# Altium schematic sheet 1_P1.schdoc.schdoc (part 2 of 2)
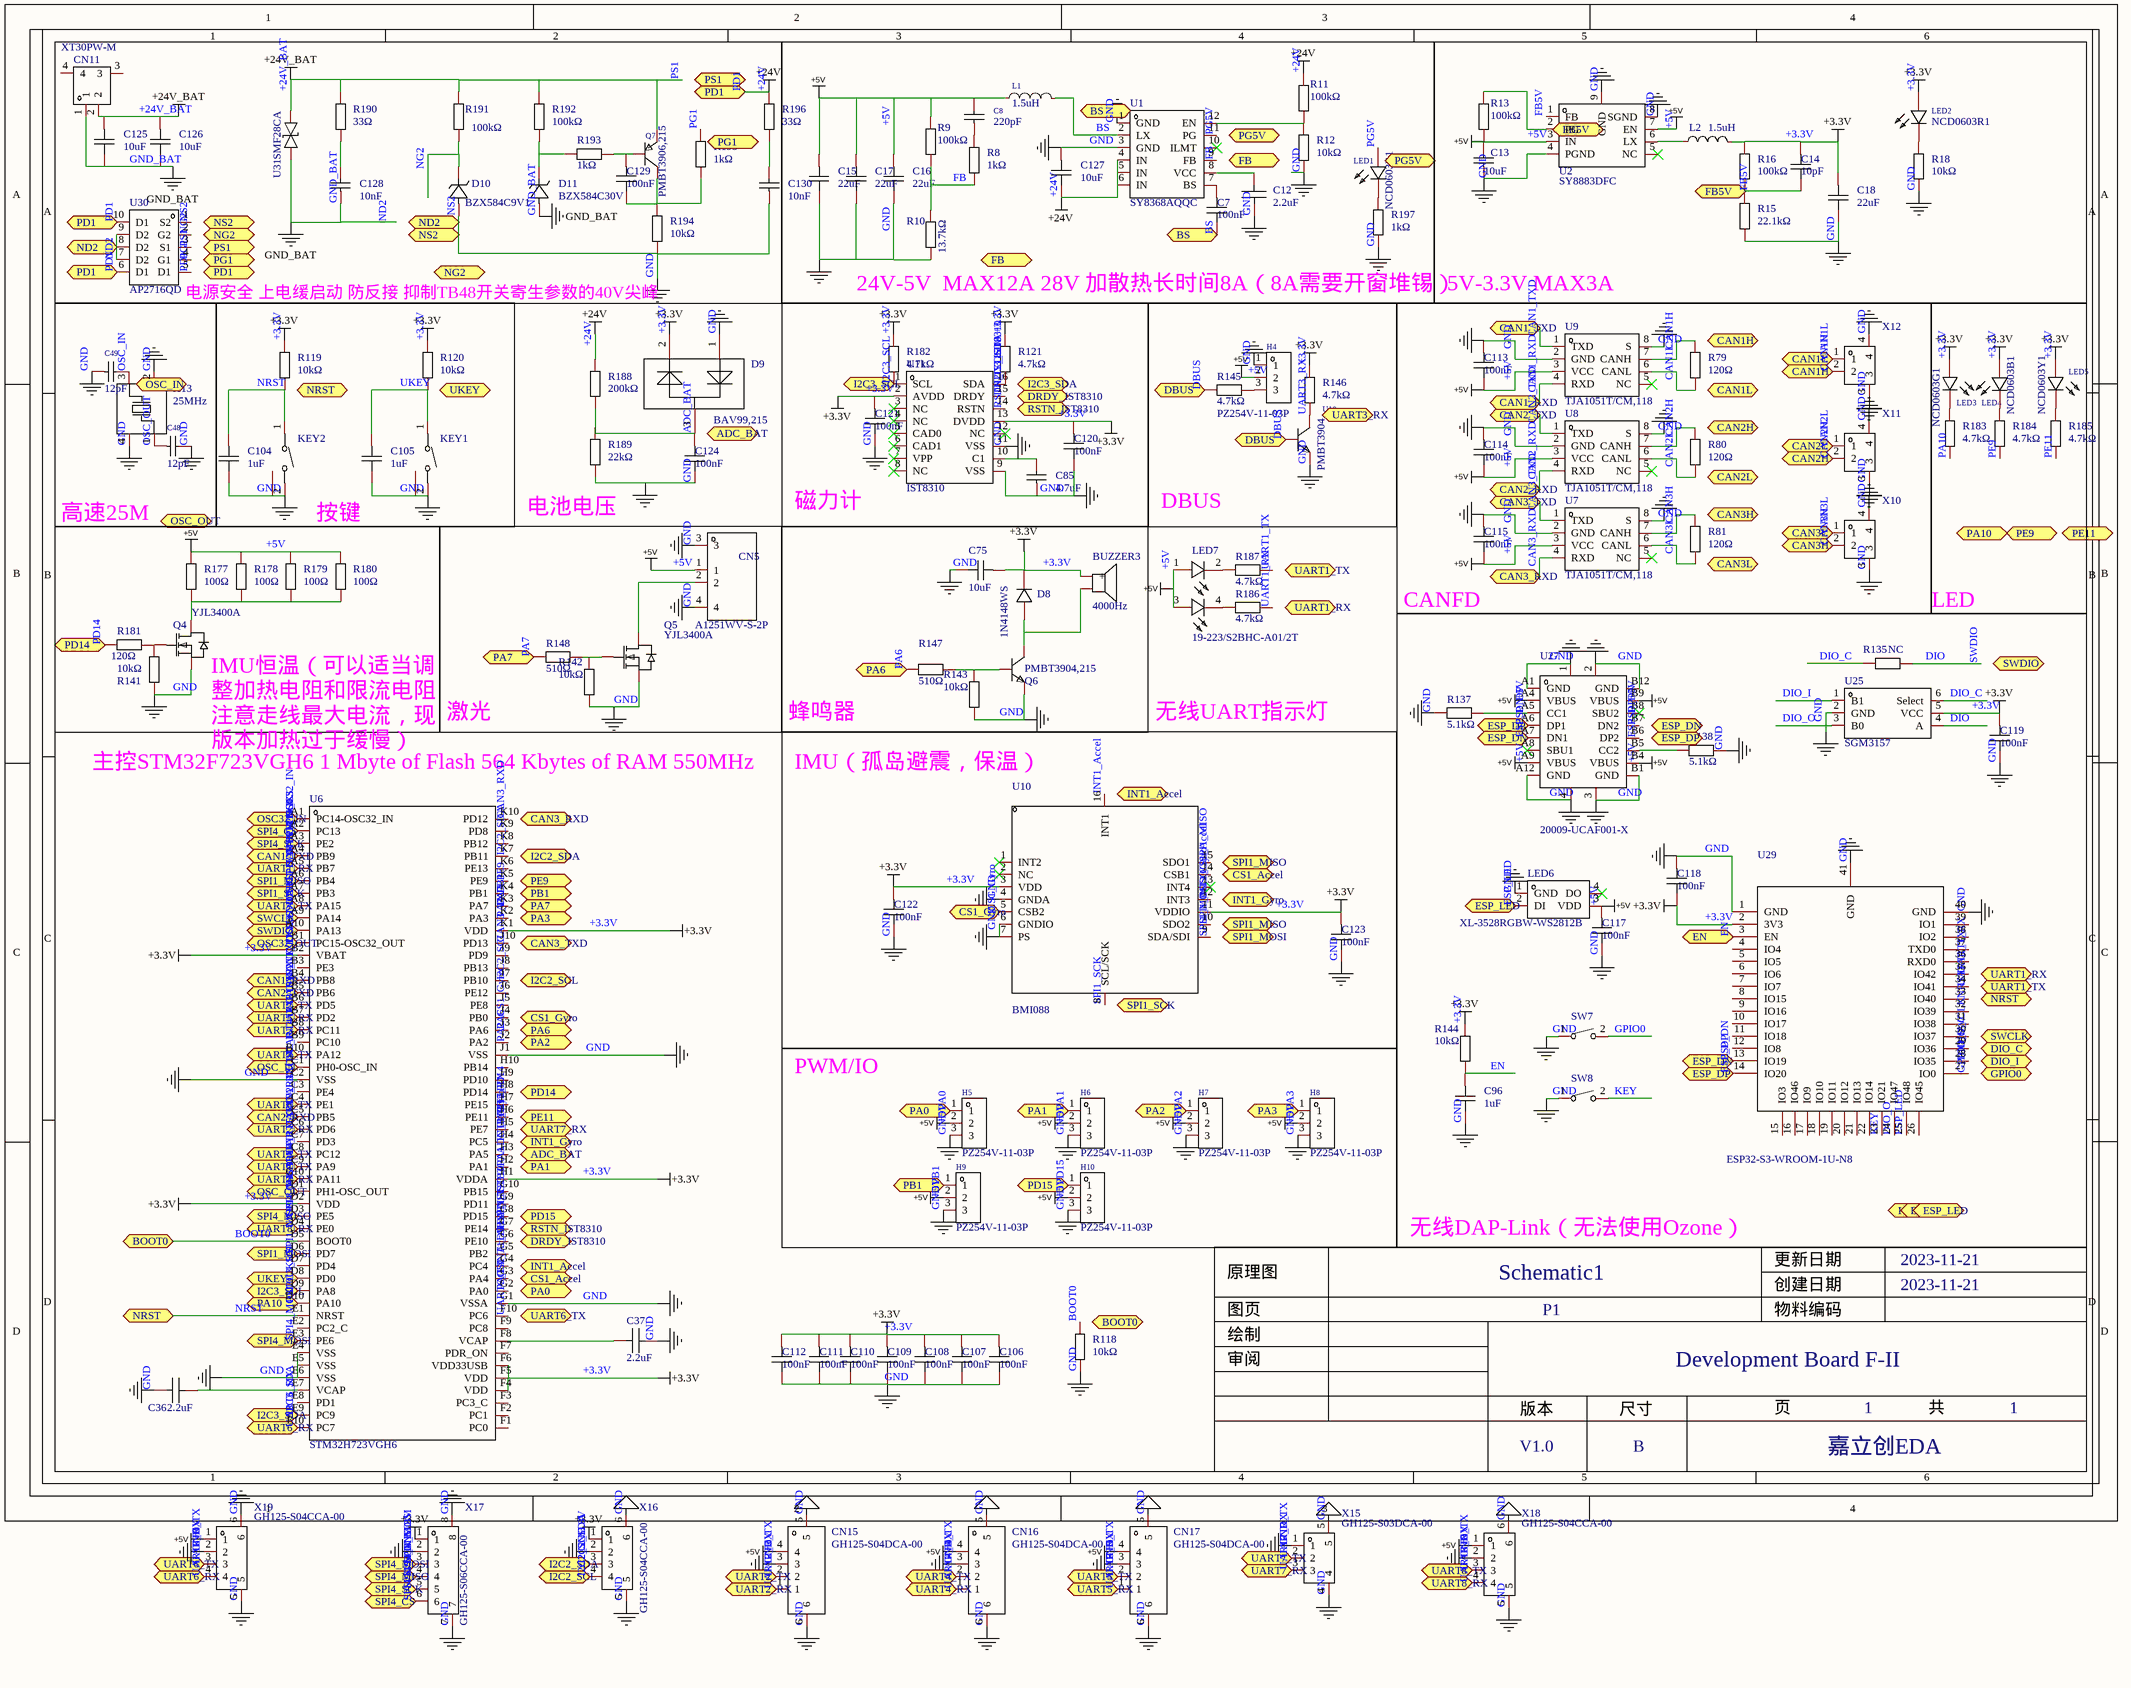
[diagram p1: 1_P1.schdoc.schdoc]

## Library data of the parts
BUZZER3 = FUET-4020: 驱动方式:无源(外部驱动);构造类型:电磁式;额定电压:3V;工作电压:2V~4V;频率:4000Hz;声压(SPL):65dB@3V,10cm;长度:4mm;宽度:4mm;高度:2.5mm;; Manufacturer: FUET(福声科技); Add into BOM: yes; Technology Type: 电磁式; Rated Voltage: 3V; Operating Voltage: 2V~4V; Name: 4000Hz; Symbol: FST-4020; Device: FUET-4020; LCSC Part Name: 电压 3V 频率 4KHZ; Supplier Part: C391027; Manufacturer Part: FUET-4020; Supplier Footprint: SMD; JLCPCB Part Class: 扩展库; Datasheet: https://atta.szlcsc.com/upload/public/pdf/source/20191031/C391027_1FC1E5FCD05180B5ABC7B83EB3465454.pdf; Supplier: LCSC; Convert to PCB: yes; Oscillator Circuit: 无源(外部驱动); Value: 4000Hz; Sound Pressure Level (SPL): 65dB@3V,10cm; Length: 4mm; Width: 4mm; Height: 2.5mm
C7 C106-C115 C117-C124 C129 = CL05B104KB54PNC: 容值:100nF;精度:±10%;额定电压:50V;材质(温度系数):X7R;; Manufacturer: SAMSUNG(三星); Add into BOM: yes; Tolerance: ±10%; Voltage Rated: 50V; Temperature Coefficient: X7R; Name: 100nF; Symbol: CL05B104KB54PNC; Device: CL05B104KB54PNC; LCSC Part Name: 100nF ±10% 50V; Supplier Part: C307331; Manufacturer Part: CL05B104KB54PNC; Supplier Footprint: 0402; JLCPCB Part Class: 基础库; Datasheet: https://atta.szlcsc.com/upload/public/pdf/source/20181009/C307331_222F7C870FD3EA5F46F538B483443886.pdf; Supplier: LCSC; Convert to PCB: yes; Value: 100nF
C8 = 0402B221K500NT: 容值:220pF;精度:±10%;额定电压:50V;材质(温度系数):X7R;; Manufacturer: FH(风华); Add into BOM: yes; Tolerance: ±10%; Voltage Rated: 50V; Temperature Coefficient: X7R; Name: 220pF; Symbol: 0402B221K500NT; Device: 0402B221K500NT; LCSC Part Name: 220pF ±10% 50V; Supplier Part: C1530; Manufacturer Part: 0402B221K500NT; Supplier Footprint: 0402; JLCPCB Part Class: 基础库; Datasheet: https://atta.szlcsc.com/upload/public/pdf/source/20200305/C486355_26A10D38EF8C2A5C37091D0039909270.pdf; Supplier: LCSC; Convert to PCB: yes; Value: 220pF; Capacitance: 220pF
C12 C36 C37 = CL05A225MQ5NSNC: 容值:2.2uF;精度:±20%;额定电压:6.3V;材质(温度系数):X5R;; Manufacturer: SAMSUNG(三星); Add into BOM: yes; Tolerance: ±20%; Voltage Rated: 6.3V; Temperature Coefficient: X5R; Name: 2.2uF; Symbol: CL05A225MQ5NSNC; Device: CL05A225MQ5NSNC; LCSC Part Name: 2.2uF ±20% 6.3V; Supplier Part: C12530; Manufacturer Part: CL05A225MQ5NSNC; Supplier Footprint: 0402; Datasheet: https://atta.szlcsc.com/upload/public/pdf/source/20160103/1457707666860.pdf; Supplier: LCSC; Convert to PCB: yes; Value: 2.2uF
  C12: JLCPCB Part Class: 基础库
  C36 C37: JLCPCB Part Class: Basic Part
C13 = CL05A106MQ5NUNC: 容值:10uF;精度:±20%;额定电压:6.3V;材质(温度系数):X5R;; Manufacturer: SAMSUNG(三星); Add into BOM: yes; Tolerance: ±20%; Voltage Rated: 6.3V; Temperature Coefficient: X5R; Name: 10uF; Symbol: CL05A106MQ5NUNC; Device: CL05A106MQ5NUNC; LCSC Part Name: 10uF ±20% 6.3V; Supplier Part: C15525; Manufacturer Part: CL05A106MQ5NUNC; Supplier Footprint: 0402; JLCPCB Part Class: 基础库; Datasheet: https://atta.szlcsc.com/upload/public/pdf/source/20220823/2B02EE04F8F211D38A52DCB16EB6BEBA.pdf; Supplier: LCSC; Convert to PCB: yes; Value: 10uF
C14 = CL05C100JB5NNNC: 容值:10pF;精度:±5%;额定电压:50V;材质(温度系数):C0G;; Manufacturer: SAMSUNG(三星); Add into BOM: yes; Tolerance: ±5%; Voltage Rated: 50V; Temperature Coefficient: C0G; Name: 10pF; Symbol: CL05C100JB5NNNC; Device: CL05C100JB5NNNC; LCSC Part Name: 10pF ±5% 50V; Supplier Part: C32949; Manufacturer Part: CL05C100JB5NNNC; Supplier Footprint: 0402; JLCPCB Part Class: 基础库; Datasheet: https://atta.szlcsc.com/upload/public/pdf/source/20160103/1457707722238.pdf; Supplier: LCSC; Convert to PCB: yes; Value: 10pF
C15-C18 = CL10A226MQ8NRNC: 容值:22uF;精度:±20%;额定电压:6.3V;材质(温度系数):X5R;; Manufacturer: SAMSUNG(三星); Add into BOM: yes; Tolerance: ±20%; Voltage Rated: 6.3V; Temperature Coefficient: X5R; Name: 22uF; Symbol: CL10A226MQ8NRNC; Device: CL10A226MQ8NRNC; LCSC Part Name: 22uF ±20% 6.3V; Supplier Part: C59461; Manufacturer Part: CL10A226MQ8NRNC; Supplier Footprint: 0603; JLCPCB Part Class: 基础库; Datasheet: https://atta.szlcsc.com/upload/public/pdf/source/20160218/1457707763339.pdf; Supplier: LCSC; Convert to PCB: yes; Value: 22uF
C48 C49 = 0402CG120J500NT: 容值:12pF;精度:±5%;额定电压:50V;材质(温度系数):C0G;; Manufacturer: FH(风华); Add into BOM: yes; Tolerance: ±5%; Voltage Rated: 50V; Temperature Coefficient: C0G; Name: 12pF; Symbol: 0402CG120J500NT; Device: 0402CG120J500NT; LCSC Part Name: 12pF ±5% 50V; Supplier Part: C1547; Manufacturer Part: 0402CG120J500NT; Supplier Footprint: 0402; JLCPCB Part Class: Basic Part; Datasheet: https://atta.szlcsc.com/upload/public/pdf/source/20200305/C486355_26A10D38EF8C2A5C37091D0039909270.pdf; Supplier: LCSC; Convert to PCB: yes; Value: 12pF; Capacitance: 12pF
C75 = CL10A106MA8NRNC: 容值:10uF;精度:±20%;额定电压:25V;材质(温度系数):X5R;; Manufacturer: SAMSUNG(三星); Add into BOM: yes; Tolerance: ±20%; Voltage Rated: 25V; Temperature Coefficient: X5R; Name: 10uF; Symbol: CL10A106MA8NRNC; Device: CL10A106MA8NRNC; LCSC Part Name: 10uF ±20% 25V; Supplier Part: C96446; Manufacturer Part: CL10A106MA8NRNC; Supplier Footprint: 0603; JLCPCB Part Class: 基础库; Datasheet: https://atta.szlcsc.com/upload/public/pdf/source/20170325/1490427913016.pdf; Supplier: LCSC; Convert to PCB: yes; Value: 10uF
C85 = CL05A475MP5NRNC: 容值:4.7uF;精度:±20%;额定电压:10V;材质(温度系数):X5R;; Manufacturer: SAMSUNG(三星); Add into BOM: yes; Tolerance: ±20%; Voltage Rated: 10V; Temperature Coefficient: X5R; Name: 4.7uF; Symbol: CL05A475MP5NRNC; Device: CL05A475MP5NRNC; LCSC Part Name: 4.7uF ±20% 10V; Supplier Part: C23733; Manufacturer Part: CL05A475MP5NRNC; Supplier Footprint: 0402; JLCPCB Part Class: 基础库; Datasheet: https://atta.szlcsc.com/upload/public/pdf/source/20160103/1457707710457.pdf; Supplier: LCSC; Convert to PCB: yes; Value: 4.7uF
C96 C104 C105 = CL05A105KA5NQNC: 容值:1uF;精度:±10%;额定电压:25V;材质(温度系数):X5R;; Manufacturer: SAMSUNG(三星); Add into BOM: yes; Tolerance: ±10%; Voltage Rated: 25V; Temperature Coefficient: X5R; Name: 1uF; Symbol: CL05A105KA5NQNC; Device: CL05A105KA5NQNC; LCSC Part Name: 1uF ±10% 25V; Supplier Part: C52923; Manufacturer Part: CL05A105KA5NQNC; Supplier Footprint: 0402; JLCPCB Part Class: 基础库; Datasheet: https://atta.szlcsc.com/upload/public/pdf/source/20160103/1457707735223.pdf; Supplier: LCSC; Convert to PCB: yes; Value: 1uF
C125-C127 = GRM21BR61H106KE43L: 容值:10uF;精度:±10%;额定电压:50V;材质(温度系数):X5R;; Manufacturer: muRata(村田); Add into BOM: yes; Tolerance: ±10%; Voltage Rated: 50V; Temperature Coefficient: X5R; Name: 10uF; Symbol: GRM21BR61H106KE43L; Device: GRM21BR61H106KE43L; LCSC Part Name: 10uF ±10% 50V; Supplier Part: C440198; Manufacturer Part: GRM21BR61H106KE43L; Supplier Footprint: 0805; JLCPCB Part Class: 基础库; Datasheet: https://atta.szlcsc.com/upload/public/pdf/source/20191220/C440198_2DEA1B9834E321C8893F7972E9DFE5B0.pdf; Supplier: LCSC; Convert to PCB: yes; Value: 10uF
C128 C130 = CL05B103KB5NNNC: 容值:10nF;精度:±10%;额定电压:50V;材质(温度系数):X7R;; Manufacturer: SAMSUNG(三星); Add into BOM: yes; Tolerance: ±10%; Voltage Rated: 50V; Temperature Coefficient: X7R; Name: 10nF; Symbol: CL05B103KB5NNNC; Device: CL05B103KB5NNNC; LCSC Part Name: 10nF ±10% 50V; Supplier Part: C15195; Manufacturer Part: CL05B103KB5NNNC; Supplier Footprint: 0402; JLCPCB Part Class: 基础库; Datasheet: https://atta.szlcsc.com/upload/public/pdf/source/20160103/1457707674468.pdf; Supplier: LCSC; Convert to PCB: yes; Value: 10nF
CN5 = A1251WV-S-2P: 参考系列:-;间距:1.25mm;插针结构:1x2P;排数:1;每排PIN数:2;行距:-;安装方式:-;触头材质:磷青铜;; Manufacturer: CJT(长江连接器); Add into BOM: yes; Pitch: 1.25mm; Pins Structure: 1x2P; Number of PINs Per Row: 2; Name: A1251WV-S-2P; Symbol: A1251WV-S-2P; Device: A1251WV-S-2P; LCSC Part Name: 1.25mm 1x2P 镀锡; Supplier Part: C225104; Manufacturer Part: A1251WV-S-2P; Supplier Footprint: SMD,P=1.25mm; JLCPCB Part Class: 扩展库; Datasheet: https://atta.szlcsc.com/upload/public/pdf/source/20180509/C225104_35B4868FFB7D8A864E1EEFC552D9B5A2.pdf; Supplier: LCSC; Convert to PCB: yes; Reference Series: -; Number of Rows: 1; Row Spacing: -; Mounting Style: -; Contact Material: 磷青铜
CN11 = XT30PW-M: Socket,DCsupply,XT30,male,PIN:2; Manufacturer: AMASS(艾迈斯); Add into BOM: yes; Name: XT30PW-M; Symbol: XT30PW-M; Device: XT30PW-M; LCSC Part Name: AMASS(艾迈斯)航模插头 卧式弯脚 XT30PW-M公头; Supplier Part: C431092; Manufacturer Part: XT30PW-M; Supplier Footprint: -; JLCPCB Part Class: Extended Part; Datasheet: https://atta.szlcsc.com/upload/public/pdf/source/20220222/6A9F22F7850E25B33E1BE430ADF8560B.pdf; Supplier: LCSC; Convert to PCB: yes
CN15-CN17 = GH125-S04DCA-00: 参考系列:-;间距:1.25mm;插针结构:1x4P;排数:1;每排PIN数:4;行距:-;公母:公型插针;安装方式:卧贴;额定电流:1A;工作温度范围:-25℃~+85℃;; Manufacturer: JS(钜硕电子); Add into BOM: yes; Pitch: 1.25mm; Pins Structure: 1x4P; Number of PINs Per Row: 4; Gender: 公型插针; Current Rating (Max): 1A; Name: GH125-S04DCA-00; Symbol: GH125-S04DCA-00; Device: GH125-S04DCA-00; LCSC Part Name: GH1.25卧式贴片 带扣; Supplier Part: C2886767; Manufacturer Part: GH125-S04DCA-00; Supplier Footprint: SMD,P=1.25mm; JLCPCB Part Class: 扩展库; Datasheet: https://atta.szlcsc.com/upload/public/pdf/source/20210818/CD11791E5ED3EDF45A7009E9C8A2BD4C.pdf; Supplier: LCSC; Convert to PCB: yes; Reference Series: -; Number of Rows: 1; Row Spacing: -; Mounting Style: 卧贴; Operating Temperature Range: -25℃~+85℃
D8 = 1N4148WS_C2128: 二极管配置:独立式;功率:200mW;直流反向耐压(Vr):100V;平均整流电流(Io):150mA;正向压降(Vf):1.25V@150mA;反向电流(Ir):1uA@75V;反向恢复时间(trr):4ns;工作温度:+150℃@(Tj);; Manufacturer: CJ(江苏长电/长晶); Symbol: 1N4148WS T4; Add into BOM: yes; Diode Configuration: 独立式; Power Dissipation: 200mW; Reverse Voltage (Vr): 100V; Average Rectified Current (Io): 150mA; Reverse Recovery Time (trr): 4ns; Name: 1N4148WS; Device: 1N4148WS_C2128; LCSC Part Name: 100V 150mA 4ns T4; Supplier Part: C2128; Manufacturer Part: 1N4148WS; Supplier Footprint: SOD-323; JLCPCB Part Class: 基础库; Datasheet: https://atta.szlcsc.com/upload/public/pdf/source/20140809/1457707208178.pdf; Supplier: LCSC; Convert to PCB: yes; Forward Voltage (Vf@If): 1.25V@150mA; Reverse Leakage Current: 1uA@75V; Operating Temperature: +150℃@(Tj)
D9 = BAV99,215: 二极管配置:1对串联式;功率:250mW;直流反向耐压(Vr):100V;平均整流电流(Io):215mA;正向压降(Vf):1.25V@150mA;反向恢复时间(trr):4ns;; Manufacturer: Nexperia(安世); Add into BOM: yes; Diode Configuration: 1对串联式; Power Dissipation: 250mW; Reverse Voltage (Vr): 100V; Average Rectified Current (Io): 215mA; Reverse Leakage Current: 500nA@80V; Reverse Recovery Time (trr): 4ns; Name: BAV99,215; Symbol: BAV99,215; Device: BAV99,215; LCSC Part Name: 100V 215mA 1.25V@150mA; Supplier Part: C2500; Manufacturer Part: BAV99,215; Supplier Footprint: SOT-23; JLCPCB Part Class: 基础库; Datasheet: https://atta.szlcsc.com/upload/public/pdf/source/20151007/1457707426030.pdf; Supplier: LCSC; Convert to PCB: yes; Forward Voltage (Vf@If): 1.25V@150mA; Operating Temperature: +150℃@(Tj)
D10 = BZX584C9V1: 二极管配置:独立式;稳压值(标称值):9.1V;稳压值(范围):8.5V~9.6V;精度:-;功率:200mW;反向电流(Ir):200nA@7V;阻抗(Zzt):15Ω;; Manufacturer: YANGJIE(扬杰); Add into BOM: yes; Diode Configuration: 独立式; Zener Voltage (Nom): 9.1V; Power Dissipation: 200mW; Zener Impedance (Zzt): 15Ω; Name: BZX584C9V1; Symbol: BZX584C9V1; Device: BZX584C9V1; LCSC Part Name: 9.1V 200mW; Supplier Part: C968211; Manufacturer Part: BZX584C9V1; Supplier Footprint: SOD-523; JLCPCB Part Class: 扩展库; Datasheet: https://atta.szlcsc.com/upload/public/pdf/source/20201222/C968180_8DEF4A0FE776E72B62938E062B6263B6.pdf; Supplier: LCSC; Convert to PCB: yes; Zener Voltage (Range): 8.5V~9.6V; Tolerance: -; Reverse Leakage Current (Ir): 200nA@7V
D11 = BZX584C30V: 二极管配置:独立式;稳压值(标称值):30V;稳压值(范围):28V~32V;精度:-;功率:200mW;反向电流(Ir):50nA@21V;阻抗(Zzt):80Ω;; Manufacturer: YANGJIE(扬杰); Add into BOM: yes; Diode Configuration: 独立式; Zener Voltage (Nom): 30V; Power Dissipation: 200mW; Zener Impedance (Zzt): 80Ω; Name: BZX584C30V; Symbol: BZX584C30V; Device: BZX584C30V; LCSC Part Name: 30V 200mW; Supplier Part: C968193; Manufacturer Part: BZX584C30V; Supplier Footprint: SOD-523; JLCPCB Part Class: 扩展库; Datasheet: https://atta.szlcsc.com/upload/public/pdf/source/20201222/C968180_8DEF4A0FE776E72B62938E062B6263B6.pdf; Supplier: LCSC; Convert to PCB: yes; Zener Voltage (Range): 28V~32V; Tolerance: -; Reverse Leakage Current (Ir): 50nA@21V
H4-H10 = PZ254V-11-03P: 排数:单排;总PIN位数:3;间距:2.54mm;插针结构:1x3P;行距:-;安装类型:直插;圆针/方针:方针;额定电流:3A;额定电压:250V;配合针长度:6mm;塑高:2.5mm;端接针长度:3mm;工作温度范围:-40℃~+105℃;颜色:黑色;; Manufacturer: XFCN(兴飞); Symbol: PZ254V-11-03P_C2937625; Add into BOM: yes; Pitch: 2.54mm; Pin Structure: 1x3P; Circluar Pins/Square Pins: 方针; Current Rating (Max): 3A; Voltage Rating (Max): 250V; Name: PZ254V-11-03P; Device: PZ254V-11-03P; LCSC Part Name: 2.54mm 1x3P 直插 方针; Supplier Part: C2937625; Manufacturer Part: PZ254V-11-03P; Supplier Footprint: 直插,P=2.54mm; JLCPCB Part Class: 扩展库; Datasheet: 2022-07-12/581362A/62b9d00620994b3696be7eb4af85ad72/双排排针和单排排针.pdf; Supplier: LCSC; Convert to PCB: yes; Number of Rows: 单排; Number of Pins: 3; Row Spacing: -; Mounting Type: 直插; Length of Mating Pin: 6mm; Insulation Height: 2.5mm; Length of End Connection Pin: 3mm; Operating Temperature Range: -40℃~+105℃; Color: 黑色
KEY1 KEY2 = 1TS003B-2500-3500A-CT: 触点电流:50mA;额定电压(DC):12V;额定功率:0.6W;绝缘电阻:100MΩ;电路结构:单刀单掷;安装方式:卧贴;带灯:无;作用力:250gf@±50gf;机械寿命:1.5万次;带支架:否;; Manufacturer: HYP(鸿源精密); Add into BOM: yes; Contact Current: 50mA; Voltage Rating (DC): 12V; Power Rating: 0.6W; Insulation Resistance: 100MΩ; Circuit: 单刀单掷; Actuator Style: 矩形按钮; Actuator/Cap Color: 黑色; With Lamp: 无; Mechanical Life: 1.5万次; Pin Style: J型引脚; Switch Length: 4.6mm; Switch Width: 1.82mm; Switch Height: 3.5mm; Strike Gundam: 否; Name: 1TS003B-2500-3500A-CT; Symbol: 1TS003B-2500-3500A; Device: 1TS003B-2500-3500A-CT; LCSC Part Name: 4.6*1.82*3.5mm 卧贴 轻触开关; Supplier Part: C255810; Manufacturer Part: 1TS003B-2500-3500A-CT; Supplier Footprint: SMD,2x4mm; JLCPCB Part Class: 扩展库; Datasheet: https://atta.szlcsc.com/upload/public/pdf/source/20180720/C255810_F77B30B42331AEA91D48A1AA0FBA2945.pdf; Supplier: LCSC; Convert to PCB: yes; Mounting Style: 卧贴; Operating Force: 250gf@±50gf; Operating Temperature: -40℃~+90℃
L1 = FXL0624-1R5-M: 类型:一体成型电感;电感值:1.5uH;精度:±20%;额定电流:9A;饱和电流(Isat):15A;; Manufacturer: cjiang(长江微电); Add into BOM: yes; Type: 一体成型电感; Tolerance: ±20%; Rated Current: 9A; Saturation Current (Isat): 15A; DC Resistance (DCR): 20mΩ; Name: 1.5uH; Symbol: FXL0624-1R5-M; Device: FXL0624-1R5-M; LCSC Part Name: 1.5uH ±20% 15A; Supplier Part: C524603; Manufacturer Part: FXL0624-1R5-M; Supplier Footprint: SMD,6.6x7mm; JLCPCB Part Class: 扩展库; Datasheet: https://atta.szlcsc.com/upload/public/pdf/source/20230516/0866C3D179493295F2274FDF9DB6F780.pdf; Supplier: LCSC; Convert to PCB: yes; Value: 1.5uH
L2 = DFE201610E-1R5M=P2: 电感值:1.5uH;精度:±20%;额定电流:-;饱和电流(Isat):-;; Manufacturer: muRata(村田); Add into BOM: yes; Tolerance: ±20%; Name: 1.5uH; Symbol: DFE201610E-1R5M=P2; Device: DFE201610E-1R5M=P2; LCSC Part Name: 1.5uH ±20%; Supplier Part: C668311; Manufacturer Part: DFE201610E-1R5M=P2; Supplier Footprint: SMD; JLCPCB Part Class: 扩展库; Datasheet: https://atta.szlcsc.com/upload/public/pdf/source/20190513/C337891_E8F53E7A275D0CF4365E41AA9943B04D.pdf; Supplier: LCSC; Convert to PCB: yes; Value: 1.5uH; Rated Current: -; Saturation Current (Isat): -; DC Resistance (DCR): -; Ratings: -
LED1 LED2 = NCD0603R1_C84263: 发光颜色:红灯;; Manufacturer: 国星光电; Symbol: FC-DA1608HRK-620D; Add into BOM: yes; Emitted Color: 红灯; Name: NCD0603R1; Device: NCD0603R1_C84263; LCSC Part Name: 红灯 0603红灯   正贴; Supplier Part: C84263; Manufacturer Part: NCD0603R1; Supplier Footprint: 0603; JLCPCB Part Class: 扩展库; Datasheet: https://atta.szlcsc.com/upload/public/pdf/source/20200820/C84263_DABC6A75E58F576973B407FDBA283D60.pdf; Supplier: LCSC; Convert to PCB: yes
LED3 = NCD0603G1: 发光颜色:翠绿;; Manufacturer: 国星光电; Symbol: FC-D1608UGK-520D10; Add into BOM: yes; Emitted Color: 翠绿; Name: NCD0603G1; Device: NCD0603G1; LCSC Part Name: 翠绿 0603翠绿  正贴; Supplier Part: C84267; Manufacturer Part: NCD0603G1; Supplier Footprint: 0603; JLCPCB Part Class: 扩展库; Datasheet: https://atta.szlcsc.com/upload/public/pdf/source/20200820/C84267_04BA7703640BAC111D09F5EFB971FBF3.pdf; Supplier: LCSC; Convert to PCB: yes
LED4 = NCD0603B1: 发光颜色:蓝灯;; Manufacturer: 国星光电; Symbol: FC-DA1608BK-470H10; Add into BOM: yes; Emitted Color: 蓝灯; Name: NCD0603B1; Device: NCD0603B1; LCSC Part Name: 蓝灯; Supplier Part: C84266; Manufacturer Part: NCD0603B1; Supplier Footprint: 0603; JLCPCB Part Class: 扩展库; Datasheet: https://atta.szlcsc.com/upload/public/pdf/source/20200820/C84266_6A3CDBEFA72C6CAD68EDA53474ADAE6C.pdf; Supplier: LCSC; Convert to PCB: yes
LED5 = NCD0603Y1: 发光颜色:黄灯;; Manufacturer: 国星光电; Symbol: FC-D1608HYK-588J; Add into BOM: yes; Emitted Color: 黄灯; Name: NCD0603Y1; Device: NCD0603Y1; LCSC Part Name: NCD0603Y1; Supplier Part: C84268; Manufacturer Part: NCD0603Y1; Supplier Footprint: 0603; JLCPCB Part Class: 扩展库; Datasheet: https://atta.szlcsc.com/upload/public/pdf/source/20200820/C84268_8FC106CB292CF978F9CFC6892464F83C.pdf; Supplier: LCSC; Convert to PCB: yes
LED6 = XL-3528RGBW-WS2812B: 发光颜色:RGB三色;二极管配置:-;主波长:618nm~623nm；520nm~525nm；467nm~472nm;功率:50mW；50mW；45mW;安装方式:正贴;; Manufacturer: XINGLIGHT(成兴光); Add into BOM: yes; Emitted Color: RGB三色; Peak Wavelength: 525nm；623nm；472nm; Forward Current: 20mA; Viewing Angle: 120°; Mounting Sytle: 正贴; Name: XL-3528RGBW-WS2812B; Symbol: XL-3528RGBW-WS2812B; Device: XL-3528RGBW-WS2812B; LCSC Part Name: RGB三色 正贴 幻彩; Supplier Part: C2890364; Manufacturer Part: XL-3528RGBW-WS2812B; Supplier Footprint: SMD3528-4P; JLCPCB Part Class: 扩展库; Datasheet: https://atta.szlcsc.com/upload/public/pdf/source/20221102/50F456983F591359B0D81AA557777463.pdf; Supplier: LCSC; Convert to PCB: yes; Diode Configuration: -; Dominant Wavelength: 618nm~623nm；520nm~525nm；467nm~472nm; Power Dissipation: 50mW；50mW；45mW; Operating Temperature: -25℃~+80℃
LED7 = 19-223/S2BHC-A01/2T: 发光颜色:橙灯,蓝灯;二极管配置:-;透镜颜色:无色透明;主波长:470nm；605nm;色温:-;功率:60mW；75mW;发光角度:120°;安装方式:-;工作温度:-40℃~+85℃;; Manufacturer: EVERLIGHT(亿光); Add into BOM: yes; Emitted Color: 橙灯,蓝灯; Lens Color: 无色透明; Peak Wavelength: 611nm；468nm; Forward Current: 20mA; Viewing Angle: 120°; Name: 19-223/S2BHC-A01/2T; Symbol: 19-223/S2BHC-A01/2T; Device: 19-223/S2BHC-A01/2T; LCSC Part Name: 橙灯,蓝灯; Supplier Part: C883171; Manufacturer Part: 19-223/S2BHC-A01/2T; Supplier Footprint: 0606; JLCPCB Part Class: 扩展库; Datasheet: https://atta.szlcsc.com/upload/public/pdf/source/20201103/C883171_5F9DC7D6FE738F23ABB8905D22F05F10.pdf; Supplier: LCSC; Convert to PCB: yes; Diode Configuration: -; Dominant Wavelength: 470nm；605nm; Color Temperature: -; Power Dissipation: 60mW；75mW; Mounting Sytle: -; Operating Temperature: -40℃~+85℃
Q4 Q5 = YJL3400A: 类型:N沟道;漏源电压(Vdss):30V;连续漏极电流(Id):5.6A;功率(Pd):1.2W;导通电阻(RDS(on)@Vgs,Id):27mΩ@10V,5.6A;; Manufacturer: YANGJIE(扬杰); Add into BOM: yes; Type: N沟道; Drain Source Voltage (Vdss): 30V; Power Dissipation (Pd): 1.2W; Gate Threshold Voltage (Vgs(th)@Id): 1.5V@250uA; Name: YJL3400A; Symbol: YJL3400A; Device: YJL3400A; LCSC Part Name: N沟道 30V 5.6A; Supplier Part: C699302; Manufacturer Part: YJL3400A; Supplier Footprint: SOT-23-3L; JLCPCB Part Class: 扩展库; Datasheet: https://atta.szlcsc.com/upload/public/pdf/source/20200709/C699302_C2B88B69139871D2E58BC98BB548FF51.pdf; Supplier: LCSC; Convert to PCB: yes; Continuous Drain Current (Id): 5.6A; Drain Source On Resistance (RDS(on)@Vgs,Id): 27mΩ@10V,5.6A
Q6 = PMBT3904,215: 晶体管类型:NPN;集射极击穿电压(Vceo):40V;集电极电流(Ic):200mA;功率(Pd):250mW;直流电流增益(hFE@Ic,Vce):100@10mA,1V;; Manufacturer: Nexperia(安世); Add into BOM: yes; Transistor Type: NPN; Collector-Emitter Breakdown Voltage (Vceo): 40V; Collector Current (Ic): 200mA; Power Dissipation (Pd): 250mW; Collector Cut-Off Current (Icbo): 50nA; Collector-Emitter Saturation Voltage (VCE(sat)@Ic,Ib): 300mV@50mA,5mA; Transition Frequency (fT): 300MHz; Name: PMBT3904,215; Symbol: PMBT3904,215; Device: PMBT3904,215; LCSC Part Name: NPN 40V 200mA; Supplier Part: C8667; Manufacturer Part: PMBT3904,215; Supplier Footprint: SOT-23; JLCPCB Part Class: 扩展库; Datasheet: https://atta.szlcsc.com/upload/public/pdf/source/20210520/C8667_82CC4B18F957EC74ED6E8B4E120941E6.pdf; Supplier: LCSC; Convert to PCB: yes; DC Current Gain (hFE@Ic,Vce): 100@10mA,1V; Operating Temperature: +150℃@(Tj)
Q7 = PMBT3906,215: 晶体管类型:PNP;集射极击穿电压(Vceo):40V;集电极电流(Ic):200mA;功率(Pd):250mW;直流电流增益(hFE@Ic,Vce):100@10mA,1V;; Manufacturer: Nexperia(安世); Add into BOM: yes; Transistor Type: PNP; Collector-Emitter Breakdown Voltage (Vceo): 40V; Collector Current (Ic): 200mA; Power Dissipation (Pd): 250mW; Collector Cut-Off Current (Icbo): 50nA; Collector-Emitter Saturation Voltage (VCE(sat)@Ic,Ib): 400mV@50mA,5mA; Transition Frequency (fT): 250MHz; Name: PMBT3906,215; Symbol: PMBT3906,215; Device: PMBT3906,215; LCSC Part Name: PNP 40V 200mA; Supplier Part: C8670; Manufacturer Part: PMBT3906,215; Supplier Footprint: SOT-23; JLCPCB Part Class: 扩展库; Datasheet: https://atta.szlcsc.com/upload/public/pdf/source/20130412/1457706600965.pdf; Supplier: LCSC; Convert to PCB: yes; DC Current Gain (hFE@Ic,Vce): 100@10mA,1V; Operating Temperature: +150℃@(Tj)
R8 R193 R195 R197 = 0402WGF1001TCE: 电阻类型:厚膜电阻;阻值:1kΩ;精度:±1%;功率:62.5mW;; Manufacturer: UNI-ROYAL(厚声); Add into BOM: yes; Tolerance: ±1%; Power(Watts): 62.5mW; Temperature Coefficient: ±100ppm/℃; Overload Voltage (Max): 50V; Name: 1kΩ; Symbol: 0402WGF1001TCE; Device: 0402WGF1001TCE; LCSC Part Name: 1kΩ ±1% 62.5mW; Supplier Part: C11702; Manufacturer Part: 0402WGF1001TCE; Supplier Footprint: 0402; JLCPCB Part Class: 基础库; Datasheet: https://atta.szlcsc.com/upload/public/pdf/source/20200306/C422600_1E6D84923E4A46A82E41ADD87F860B5C.pdf; Supplier: LCSC; Convert to PCB: yes; Type: 厚膜电阻; Value: 1kΩ; Operating Temperature Range: -55℃~+155℃
R9 R11 R13 R16 R191 R192 = 0402WGF1003TCE: 电阻类型:厚膜电阻;阻值:100kΩ;精度:±1%;功率:62.5mW;; Manufacturer: UNI-ROYAL(厚声); Add into BOM: yes; Tolerance: ±1%; Power(Watts): 62.5mW; Temperature Coefficient: ±100ppm/℃; Overload Voltage (Max): 50V; Name: 100kΩ; Symbol: 0402WGF1003TCE; Device: 0402WGF1003TCE; LCSC Part Name: 100kΩ ±1% 62.5mW; Supplier Part: C25741; Manufacturer Part: 0402WGF1003TCE; Supplier Footprint: 0402; JLCPCB Part Class: 基础库; Datasheet: https://atta.szlcsc.com/upload/public/pdf/source/20200306/C422600_1E6D84923E4A46A82E41ADD87F860B5C.pdf; Supplier: LCSC; Convert to PCB: yes; Type: 厚膜电阻; Value: 100kΩ; Operating Temperature Range: -55℃~+155℃
R10 = 0402WGF1372TCE: 电阻类型:厚膜电阻;阻值:13.7kΩ;精度:±1%;功率:62.5mW;温度系数:±100ppm/℃;; Manufacturer: UNI-ROYAL(厚声); Add into BOM: yes; Tolerance: ±1%; Power(Watts): 62.5mW; Overload Voltage (Max): 50V; Name: 13.7kΩ; Symbol: 0402WGF1372TCE; Device: 0402WGF1372TCE; LCSC Part Name: 厚膜电阻 13.7kΩ ±1% 62.5mW; Supplier Part: C25854; Manufacturer Part: 0402WGF1372TCE; Supplier Footprint: 0402; JLCPCB Part Class: Extended Part; Datasheet: https://atta.szlcsc.com/upload/public/pdf/source/20200306/C422600_1E6D84923E4A46A82E41ADD87F860B5C.pdf; Supplier: LCSC; Convert to PCB: yes; Type: 厚膜电阻; Value: 13.7kΩ; Temperature Coefficient: ±100ppm/℃; Operating Temperature Range: -55℃~+155℃
R12 R18 R118-R120 R194 = 0402WGF1002TCE: 电阻类型:厚膜电阻;阻值:10kΩ;精度:±1%;功率:62.5mW;温度系数:±100ppm/℃;; Manufacturer: UNI-ROYAL(厚声); Add into BOM: yes; Tolerance: ±1%; Power(Watts): 62.5mW; Overload Voltage (Max): 50V; Name: 10kΩ; Symbol: 0402WGF1002TCE; Device: 0402WGF1002TCE; LCSC Part Name: 厚膜电阻 10kΩ ±1% 62.5mW; Supplier Part: C25744; Manufacturer Part: 0402WGF1002TCE; Supplier Footprint: 0402; JLCPCB Part Class: 基础库; Datasheet: https://atta.szlcsc.com/upload/public/pdf/source/20200306/C422600_1E6D84923E4A46A82E41ADD87F860B5C.pdf; Supplier: LCSC; Convert to PCB: yes; Type: 厚膜电阻; Value: 10kΩ; Temperature Coefficient: ±100ppm/℃; Operating Temperature Range: -55℃~+155℃
R15 = 0402WGF2212TCE: 电阻类型:厚膜电阻;阻值:22.1kΩ;精度:±1%;功率:62.5mW;; Manufacturer: UNI-ROYAL(厚声); Add into BOM: yes; Tolerance: ±1%; Power(Watts): 62.5mW; Temperature Coefficient: ±100ppm/℃; Overload Voltage (Max): 50V; Name: 22.1kΩ; Symbol: 0402WGF2212TCE; Device: 0402WGF2212TCE; LCSC Part Name: 22.1kΩ ±1% 62.5mW; Supplier Part: C43473; Manufacturer Part: 0402WGF2212TCE; Supplier Footprint: 0402; JLCPCB Part Class: Extended Part; Datasheet: https://atta.szlcsc.com/upload/public/pdf/source/20200306/C422600_1E6D84923E4A46A82E41ADD87F860B5C.pdf; Supplier: LCSC; Convert to PCB: yes; Type: 厚膜电阻; Value: 22.1kΩ; Operating Temperature Range: -55℃~+155℃
R79-R81 R181 = 0402WGF1200TCE: 电阻类型:厚膜电阻;阻值:120Ω;精度:±1%;功率:62.5mW;; Manufacturer: UNI-ROYAL(厚声); Add into BOM: yes; Tolerance: ±1%; Power(Watts): 62.5mW; Temperature Coefficient: ±100ppm/℃; Overload Voltage (Max): 50V; Name: 120Ω; Symbol: 0402WGF1200TCE; Device: 0402WGF1200TCE; LCSC Part Name: 120Ω ±1% 62.5mW; Supplier Part: C25079; Manufacturer Part: 0402WGF1200TCE; Supplier Footprint: 0402; JLCPCB Part Class: 基础库; Datasheet: https://atta.szlcsc.com/upload/public/pdf/source/20200306/C422600_1E6D84923E4A46A82E41ADD87F860B5C.pdf; Supplier: LCSC; Convert to PCB: yes; Type: 厚膜电阻; Value: 120Ω; Operating Temperature Range: -55℃~+155℃
R121 R145 R146 R182-R187 = 0402WGF4701TCE: 电阻类型:厚膜电阻;阻值:4.7kΩ;精度:±1%;功率:62.5mW;; Manufacturer: UNI-ROYAL(厚声); Add into BOM: yes; Tolerance: ±1%; Power(Watts): 62.5mW; Temperature Coefficient: ±100ppm/℃; Overload Voltage (Max): 50V; Name: 4.7kΩ; Symbol: 0402WGF4701TCE; Device: 0402WGF4701TCE; LCSC Part Name: 4.7kΩ ±1% 62.5mW; Supplier Part: C25900; Manufacturer Part: 0402WGF4701TCE; Supplier Footprint: 0402; Datasheet: https://atta.szlcsc.com/upload/public/pdf/source/20200306/C422600_1E6D84923E4A46A82E41ADD87F860B5C.pdf; Supplier: LCSC; Convert to PCB: yes; Type: 厚膜电阻; Value: 4.7kΩ; Operating Temperature Range: -55℃~+155℃
  R121 R182-R187: JLCPCB Part Class: 基础库
  R145 R146: JLCPCB Part Class: Basic Part
R135 = R0402: Add into BOM: yes; Symbol: R0402; Device: R0402; Convert to PCB: yes
R137 R138 = 0402WGF5101TCE: 电阻类型:厚膜电阻;阻值:5.1kΩ;精度:±1%;功率:62.5mW;; Manufacturer: UNI-ROYAL(厚声); Add into BOM: yes; Tolerance: ±1%; Power(Watts): 62.5mW; Temperature Coefficient: ±100ppm/℃; Overload Voltage (Max): 50V; Name: 5.1kΩ; Symbol: 0402WGF5101TCE; Device: 0402WGF5101TCE; LCSC Part Name: 5.1kΩ ±1% 62.5mW; Supplier Part: C25905; Manufacturer Part: 0402WGF5101TCE; Supplier Footprint: 0402; JLCPCB Part Class: Basic Part; Datasheet: https://atta.szlcsc.com/upload/public/pdf/source/20200306/C422600_1E6D84923E4A46A82E41ADD87F860B5C.pdf; Supplier: LCSC; Convert to PCB: yes; Type: 厚膜电阻; Value: 5.1kΩ; Operating Temperature Range: -55℃~+155℃
R141-R144 = 0402WGF1002TCE: 电阻类型:厚膜电阻;阻值:10kΩ;精度:±1%;功率:62.5mW;; Manufacturer: UNI-ROYAL(厚声); Add into BOM: yes; Tolerance: ±1%; Power(Watts): 62.5mW; Temperature Coefficient: ±100ppm/℃; Overload Voltage (Max): 50V; Name: 10kΩ; Symbol: 0402WGF1002TCE; Device: 0402WGF1002TCE; LCSC Part Name: 10kΩ ±1% 62.5mW; Supplier Part: C25744; Manufacturer Part: 0402WGF1002TCE; Supplier Footprint: 0402; JLCPCB Part Class: 基础库; Datasheet: https://atta.szlcsc.com/upload/public/pdf/source/20200306/C422600_1E6D84923E4A46A82E41ADD87F860B5C.pdf; Supplier: LCSC; Convert to PCB: yes; Type: 厚膜电阻; Value: 10kΩ; Operating Temperature Range: -55℃~+155℃
R147 R148 = 0402WGF5100TCE: 电阻类型:厚膜电阻;阻值:510Ω;精度:±1%;功率:62.5mW;; Manufacturer: UNI-ROYAL(厚声); Add into BOM: yes; Tolerance: ±1%; Power(Watts): 62.5mW; Temperature Coefficient: ±100ppm/℃; Overload Voltage (Max): 50V; Name: 510Ω; Symbol: 0402WGF5100TCE; Device: 0402WGF5100TCE; LCSC Part Name: 510Ω ±1% 62.5mW; Supplier Part: C25123; Manufacturer Part: 0402WGF5100TCE; Supplier Footprint: 0402; JLCPCB Part Class: Basic Part; Datasheet: https://atta.szlcsc.com/upload/public/pdf/source/20200306/C422600_1E6D84923E4A46A82E41ADD87F860B5C.pdf; Supplier: LCSC; Convert to PCB: yes; Type: 厚膜电阻; Value: 510Ω; Operating Temperature Range: -55℃~+155℃
R177-R180 = 0603WAF1000T5E: 电阻类型:厚膜电阻;阻值:100Ω;精度:±1%;功率:100mW;温度系数:±200ppm/℃;; Manufacturer: UNI-ROYAL(厚声); Add into BOM: yes; Tolerance: ±1%; Power(Watts): 100mW; Overload Voltage (Max): 75V; Name: 100Ω; Symbol: 0603WAF1000T5E; Device: 0603WAF1000T5E; LCSC Part Name: 厚膜电阻 100Ω ±1% 100mW; Supplier Part: C22775; Manufacturer Part: 0603WAF1000T5E; Supplier Footprint: 0603; JLCPCB Part Class: 基础库; Datasheet: https://atta.szlcsc.com/upload/public/pdf/source/20200306/C422600_1E6D84923E4A46A82E41ADD87F860B5C.pdf; Supplier: LCSC; Convert to PCB: yes; Type: 厚膜电阻; Value: 100Ω; Temperature Coefficient: ±200ppm/℃; Operating Temperature Range: -55℃~+155℃
R188 = 0402WGF2003TCE: 电阻类型:厚膜电阻;阻值:200kΩ;精度:±1%;功率:62.5mW;温度系数:±100ppm/℃;; Manufacturer: UNI-ROYAL(厚声); Add into BOM: yes; Tolerance: ±1%; Power(Watts): 62.5mW; Overload Voltage (Max): 50V; Name: 200kΩ; Symbol: 0402WGF2003TCE; Device: 0402WGF2003TCE; LCSC Part Name: 厚膜电阻 200kΩ ±1% 62.5mW; Supplier Part: C25764; Manufacturer Part: 0402WGF2003TCE; Supplier Footprint: 0402; JLCPCB Part Class: 基础库; Datasheet: https://atta.szlcsc.com/upload/public/pdf/source/20200306/C422600_1E6D84923E4A46A82E41ADD87F860B5C.pdf; Supplier: LCSC; Convert to PCB: yes; Type: 厚膜电阻; Value: 200kΩ; Temperature Coefficient: ±100ppm/℃; Operating Temperature Range: -55℃~+155℃
R189 = 0402WGF2202TCE: 电阻类型:厚膜电阻;阻值:22kΩ;精度:±1%;功率:62.5mW;温度系数:±100ppm/℃;; Manufacturer: UNI-ROYAL(厚声); Add into BOM: yes; Tolerance: ±1%; Power(Watts): 62.5mW; Overload Voltage (Max): 50V; Name: 22kΩ; Symbol: 0402WGF2202TCE; Device: 0402WGF2202TCE; LCSC Part Name: 厚膜电阻 22kΩ ±1% 62.5mW; Supplier Part: C25768; Manufacturer Part: 0402WGF2202TCE; Supplier Footprint: 0402; JLCPCB Part Class: 基础库; Datasheet: https://atta.szlcsc.com/upload/public/pdf/source/20200306/C422600_1E6D84923E4A46A82E41ADD87F860B5C.pdf; Supplier: LCSC; Convert to PCB: yes; Type: 厚膜电阻; Value: 22kΩ; Temperature Coefficient: ±100ppm/℃; Operating Temperature Range: -55℃~+155℃
R190 R196 = 0402WGF330JTCE: 电阻类型:厚膜电阻;阻值:33Ω;精度:±1%;功率:62.5mW;温度系数:±100ppm/℃;; Manufacturer: UNI-ROYAL(厚声); Add into BOM: yes; Tolerance: ±1%; Power(Watts): 62.5mW; Overload Voltage (Max): 50V; Name: 33Ω; Symbol: 0402WGF330JTCE; Device: 0402WGF330JTCE; LCSC Part Name: 厚膜电阻 33Ω ±1% 62.5mW; Supplier Part: C25105; Manufacturer Part: 0402WGF330JTCE; Supplier Footprint: 0402; JLCPCB Part Class: 基础库; Datasheet: https://atta.szlcsc.com/upload/public/pdf/source/20200306/C422600_1E6D84923E4A46A82E41ADD87F860B5C.pdf; Supplier: LCSC; Convert to PCB: yes; Type: 厚膜电阻; Value: 33Ω; Temperature Coefficient: ±100ppm/℃; Operating Temperature Range: -55℃~+155℃
SW7 SW8 = TS-1185-C-A-A-A: 触点电流:50mA;额定电压(DC):12V;绝缘电阻:-;电路结构:单刀单掷;安装方式:立贴;带灯:无;作用力:260gf;机械寿命:10万次;带支架:否;; Manufacturer: XKB Connectivity(中国星坤); Add into BOM: yes; Contact Current: 50mA; Voltage Rating (DC): 12V; Circuit: 单刀单掷; Actuator Style: 圆形按钮; Actuator/Cap Color: 黑色; With Lamp: 无; Operating Force: 260gf; Mechanical Life: 10万次; Switch Length: 4mm; Switch Width: 3mm; Switch Height: 2mm; Strike Gundam: 否; Name: TS-1185-C-A-A-A; Symbol: TS-1185-C-A-A-A; Device: TS-1185-C-A-A-A; LCSC Part Name: 4*3*2mm 立贴 轻触开关; Supplier Part: C561518; Manufacturer Part: TS-1185-C-A-A-A; Supplier Footprint: SMD; JLCPCB Part Class: Extended Part; Datasheet: https://atta.szlcsc.com/upload/public/pdf/source/20211011/C2F26DC0AE1820400F54DBF49644F5A1.pdf; Supplier: LCSC; Convert to PCB: yes; Insulation Resistance: -; Mounting Style: 立贴; Operating Temperature: -30℃~+85℃
U1 = SY8368AQQC: Manufacturer: silergy(矽力杰); Add into BOM: yes; Name: SY8368AQQC; Symbol: SY8368AQQC; Device: SY8368AQQC; LCSC Part Name: SY8368AQQC; Supplier Part: C207642; Manufacturer Part: SY8368AQQC; Supplier Footprint: QFN-12(3x3); JLCPCB Part Class: 扩展库; Datasheet: https://atta.szlcsc.com/upload/public/pdf/source/20230216/4232C0095630C5F8359F22493EDE685C.pdf; Supplier: LCSC; Convert to PCB: yes
U2 = SY8883DFC: Manufacturer: silergy(矽力杰); Add into BOM: yes; Name: SY8883DFC; Symbol: SY8883DFC; Device: SY8883DFC; LCSC Part Name: SY8883DFC; Supplier Part: C3029184; Manufacturer Part: SY8883DFC; Supplier Footprint: DFN-8(2x2); JLCPCB Part Class: 扩展库; Datasheet: https://atta.szlcsc.com/upload/public/pdf/source/20220614/20054F03FB9FDBFE0401696D134E2D98.pdf; Supplier: LCSC; Convert to PCB: yes
U6 = STM32H723VGH6: 应用领域:-;CPU内核:ARM-M系列;CPU最大主频:550MHz;工作电压范围:1.62V~3.6V;程序存储容量:1MB;程序存储器类型:-;RAM总容量:-;GPIO端口数量:80;; Manufacturer: ST(意法半导体); Add into BOM: yes; CPU Maximum Speed: 550MHz; Program Storage Size: 1MB; GPIO Ports Number: 80; 16Bit Timer: 10; 32Bit Timer: 4; I2S: 5; Universal Serial Bus: 有; Name: STM32H723VGH6; Symbol: STM32H723VGH6; Device: STM32H723VGH6; LCSC Part Name: ARM-M系列 550MHz; Supplier Part: C2848033; Manufacturer Part: STM32H723VGH6; Supplier Footprint: TFBGA-100(8x8x0.8); JLCPCB Part Class: 扩展库; Datasheet: https://atta.szlcsc.com/upload/public/pdf/source/20221107/3FC9BFF347BA16183E5CC96DF77651E2.pdf; Supplier: LCSC; Convert to PCB: yes; Application Area: -; CPU Core: ARM-M系列; Operating Voltage Range: 1.62V~3.6V; Program Memory Type: -; RAM Size: -; EEPROM: -; ADC (Bit): -; DAC (Bit): -; PWM (Bit): -; 8Bit Timer: -; CAN: -; UART/USART: -; I2C: 4; SPI: 5; Internal Comparator: -; Peripheral/Function: -; communication protocol: -; Watchdog: 有; Real-Time Clock: 有; Infrared Data Association: -; Low-Voltage Detect: 有; CCP Capture/Compare: -; LCD Module: -; LED Module: -; Secure Digital Input and Output: -; Direct Memory Access: -; Internal Oscillator: -; Operating Temperature Range: -40℃~+125℃
U7-U9 = TJA1051T/CM,118: Manufacturer: NXP(恩智浦); Add into BOM: yes; Name: TJA1051T/CM,118; Symbol: TJA1051T/CM,118; Device: TJA1051T/CM,118; LCSC Part Name: TJA1051T/CM,118; Supplier Part: C2859133; Manufacturer Part: TJA1051T/CM,118; Supplier Footprint: SOIC-8; JLCPCB Part Class: 扩展库; Datasheet: https://atta.szlcsc.com/upload/public/pdf/source/20210128/C2671135_A82E49CDEFC20634F2534E8F261E286A.pdf; Supplier: LCSC; Convert to PCB: yes
U10 = BMI088: Manufacturer: Bosch(博世); Add into BOM: yes; Name: BMI088; Symbol: BMI088; Device: BMI088; LCSC Part Name: BMI088; Supplier Part: C194919; Manufacturer Part: BMI088; Supplier Footprint: LGA-16; JLCPCB Part Class: 扩展库; Datasheet: https://atta.szlcsc.com/upload/public/pdf/source/20180628/C194919_66CCF125FF968C218A4D358C68AC68D6.pdf; Supplier: LCSC; Convert to PCB: yes
U11 = IST8310: Add into BOM: yes; Name: IST8310; Symbol: IST8310; Device: IST8310; LCSC Part Name: IST8310; Supplier Part: C9900047266; Manufacturer Part: IST8310; Supplier Footprint: LGA-16; Supplier: LCSC; Convert to PCB: yes
U19 = PMBT3904: Manufacturer: PAKER(派克微); Add into BOM: yes; Name: PMBT3904; Symbol: PMBT3904; Device: PMBT3904; LCSC Part Name: PMBT3904; Supplier Part: C5278868; Manufacturer Part: PMBT3904; Supplier Footprint: SOT-23; JLCPCB Part Class: Extended Part; Supplier: LCSC; Convert to PCB: yes
U25 = SGM3157: 开关电路:-;; Manufacturer: UMW(广东友台半导体); Add into BOM: yes; Name: SGM3157; Symbol: SGM3157; Device: SGM3157; LCSC Part Name: 二选一模拟开关电路; Supplier Part: C394901; Manufacturer Part: SGM3157; Supplier Footprint: SC-70-6; JLCPCB Part Class: 扩展库; Datasheet: https://atta.szlcsc.com/upload/public/pdf/source/20220825/163C0318ED3C3969CBD04552300499AD.pdf; Supplier: LCSC; Convert to PCB: yes; Switch Circuit: -
U27 = 20009-UCAF001-X: Manufacturer: MINTRON(明硕); Add into BOM: yes; Name: 20009-UCAF001-X; Symbol: 20009-UCAF001-X; Device: 20009-UCAF001-X; LCSC Part Name: TYPE C; Supplier Part: C3148200; Manufacturer Part: 20009-UCAF001-X; Supplier Footprint: SMD; JLCPCB Part Class: 扩展库; Datasheet: https://atta.szlcsc.com/upload/public/pdf/source/20220705/4C04992B6F70FB490BC74B4779796E6C.pdf; Supplier: LCSC; Convert to PCB: yes
U29 = ESP32-S3-WROOM-1U-N8: Manufacturer: ESPRESSIF(乐鑫); Add into BOM: yes; Name: ESP32-S3-WROOM-1U-N8; Symbol: ESP32-S3-WROOM-1U-N8; Device: ESP32-S3-WROOM-1U-N8; LCSC Part Name: 通用型Wi-Fi+低功耗蓝牙MCU模组; Supplier Part: C2980297; Manufacturer Part: ESP32-S3-WROOM-1U-N8; Supplier Footprint: SMD,18x19.2mm; JLCPCB Part Class: Extended Part; Datasheet: https://atta.szlcsc.com/upload/public/pdf/source/20220628/A2AC12B3C87735CAEB7EBE2DBE80936C.pdf; Supplier: LCSC; Convert to PCB: yes
U30 = AP2716QD: 类型:1个N沟道和1个P沟道;漏源电压(Vdss):40V;连续漏极电流(Id):16A;导通电阻(RDS(on)@Vgs,Id):44mΩ@20V,16A;; Manufacturer: ALLPOWER(铨力); Add into BOM: yes; Drain Source Voltage (Vdss): 40V; Name: AP2716QD; Symbol: AP2716QD; Device: AP2716QD; LCSC Part Name: 1个N沟道和1个P沟道 耐压:40V 电流:16A; Supplier Part: C5443708; Manufacturer Part: AP2716QD; Supplier Footprint: DFN-8(3x3); Datasheet: https://atta.szlcsc.com/upload/public/pdf/source/20230412/9217773636D31B680835B9139E919C7E.pdf; Supplier: LCSC; Convert to PCB: yes; Type: 1个N沟道和1个P沟道; Continuous Drain Current (Id): 16A; Drain Source On Resistance (RDS(on)@Vgs,Id): 44mΩ@20V,16A; Gate Threshold Voltage (Vgs(th)@Id): -
U31 = SMF28CA_C2943767: 极性:双向;反向截止电压(Vrwm):28V;击穿电压:31.1V;反向漏电流(Ir):1uA;峰值脉冲电流(Ipp)@10/1000μs:4.4A;最大钳位电压:45.4V;; Manufacturer: GOODWORK(固得沃克); Add into BOM: yes; Polarity: 双向; Reverse Stand-Off Voltage (Vrwm): 28V; Breakdown Voltage: 31.1V; Reverse Leakage Current (Ir): 1uA; Peak Pulse Current (Ipp)@10/1000μs: 4.4A; Maximum Clamping Voltage: 45.4V; Name: SMF28CA; Symbol: SMF28CA_C2943767; Device: SMF28CA_C2943767; LCSC Part Name: 双向 Vrwm:28V; Supplier Part: C2943767; Manufacturer Part: SMF28CA; Supplier Footprint: SOD-123FL; JLCPCB Part Class: 扩展库; Datasheet: https://atta.szlcsc.com/upload/public/pdf/source/20220524/AA0A0E50DAB96579C66583AA0A8CF024.pdf; Supplier: LCSC; Convert to PCB: yes
X10-X12 = GH125-S02DCA-00: 参考系列:-;间距:1.25mm;插针结构:1x2P;排数:1;每排PIN数:2;行距:-;公母:公型插针;安装方式:卧贴;额定电流:1A;工作温度范围:-25℃~+85℃;; Manufacturer: JS(钜硕电子); Add into BOM: yes; Pitch: 1.25mm; Pins Structure: 1x2P; Number of PINs Per Row: 2; Gender: 公型插针; Current Rating (Max): 1A; Name: GH125-S02DCA-00; Symbol: GH125-S02DCA-00; Device: GH125-S02DCA-00; LCSC Part Name: GH1.25卧式贴片 带扣; Supplier Part: C2886765; Manufacturer Part: GH125-S02DCA-00; Supplier Footprint: SMD,P=1.25mm; JLCPCB Part Class: 扩展库; Datasheet: https://atta.szlcsc.com/upload/public/pdf/source/20210818/CD11791E5ED3EDF45A7009E9C8A2BD4C.pdf; Supplier: LCSC; Convert to PCB: yes; Reference Series: -; Number of Rows: 1; Row Spacing: -; Mounting Style: 卧贴; Operating Temperature Range: -25℃~+85℃
X13 = X322525MOB4SI: 频率:25MHz;频率公差:±10ppm;负载电容:12pF;; Manufacturer: YXC(扬兴晶振); Add into BOM: yes; Crystal Type: 贴片无源晶振; Frequency Tolerance: ±10ppm; Frequency Stability: ±30ppm; Load Capacitance: 12pF; Name: 25MHz; Symbol: X322525MOB4SI; Device: X322525MOB4SI; LCSC Part Name: 25MHz ±10ppm 12pF YSX321SL; Supplier Part: C9006; Manufacturer Part: X322525MOB4SI; Supplier Footprint: SMD3225-4P; JLCPCB Part Class: 基础库; Datasheet: https://atta.szlcsc.com/upload/public/pdf/source/20210329/C112971_1F611BDC486E193C1706F6D8EB5AA189.pdf; Supplier: LCSC; Convert to PCB: yes; Value: 25MHz; Operating Temperature: -40℃~+85℃
X15 = GH125-S03DCA-00: 参考系列:-;间距:1.25mm;插针结构:1x3P;排数:1;每排PIN数:3;行距:-;公母:公型插针;安装方式:卧贴;额定电流:1A;工作温度范围:-25℃~+85℃;; Manufacturer: JS(钜硕电子); Add into BOM: yes; Pitch: 1.25mm; Pins Structure: 1x3P; Number of PINs Per Row: 3; Gender: 公型插针; Current Rating (Max): 1A; Name: GH125-S03DCA-00; Symbol: GH125-S03DCA-00; Device: GH125-S03DCA-00; LCSC Part Name: GH1.25卧式贴片 带扣; Supplier Part: C2886766; Manufacturer Part: GH125-S03DCA-00; Supplier Footprint: SMD,P=1.25mm; JLCPCB Part Class: Extended Part; Datasheet: https://atta.szlcsc.com/upload/public/pdf/source/20210818/CD11791E5ED3EDF45A7009E9C8A2BD4C.pdf; Supplier: LCSC; Convert to PCB: yes; Reference Series: -; Number of Rows: 1; Row Spacing: -; Mounting Style: 卧贴; Operating Temperature Range: -25℃~+85℃
X16 X18 X19 = GH125-S04CCA-00: 参考系列:-;间距:1.25mm;插针结构:1x4P;排数:1;每排PIN数:4;行距:-;公母:公型插针;安装方式:立贴;额定电流:1A;工作温度范围:-25℃~+85℃;; Manufacturer: JS(钜硕电子); Add into BOM: yes; Pitch: 1.25mm; Pins Structure: 1x4P; Number of PINs Per Row: 4; Gender: 公型插针; Current Rating (Max): 1A; Name: GH125-S04CCA-00; Symbol: GH125-S04CCA-00; Device: GH125-S04CCA-00; LCSC Part Name: GH1.25立式贴片 带扣; Supplier Part: C2886782; Manufacturer Part: GH125-S04CCA-00; Supplier Footprint: SMD,P=1.25mm; JLCPCB Part Class: Extended Part; Datasheet: https://atta.szlcsc.com/upload/public/pdf/source/20210818/35C7AE18760A04DD9417CB3CEC0962A3.pdf; Supplier: LCSC; Convert to PCB: yes; Reference Series: -; Number of Rows: 1; Row Spacing: -; Mounting Style: 立贴; Operating Temperature Range: -25℃~+85℃
X17 = GH125-S06CCA-00: 参考系列:-;间距:1.25mm;插针结构:1x6P;排数:1;每排PIN数:6;行距:-;公母:公型插针;安装方式:立贴;额定电流:1A;工作温度范围:-25℃~+85℃;; Manufacturer: JS(钜硕电子); Add into BOM: yes; Pitch: 1.25mm; Pins Structure: 1x6P; Number of PINs Per Row: 6; Gender: 公型插针; Current Rating (Max): 1A; Name: GH125-S06CCA-00; Symbol: GH125-S06CCA-00; Device: GH125-S06CCA-00; LCSC Part Name: GH1.25立式贴片 带扣; Supplier Part: C2886784; Manufacturer Part: GH125-S06CCA-00; Supplier Footprint: SMD,P=1.25mm; JLCPCB Part Class: Extended Part; Datasheet: https://atta.szlcsc.com/upload/public/pdf/source/20210818/35C7AE18760A04DD9417CB3CEC0962A3.pdf; Supplier: LCSC; Convert to PCB: yes; Reference Series: -; Number of Rows: 1; Row Spacing: -; Mounting Style: 立贴; Operating Temperature Range: -25℃~+85℃